# Altium schematic sheet Set Timer.SchDoc
size A; SheetNumber: 1; SheetTotal: 1
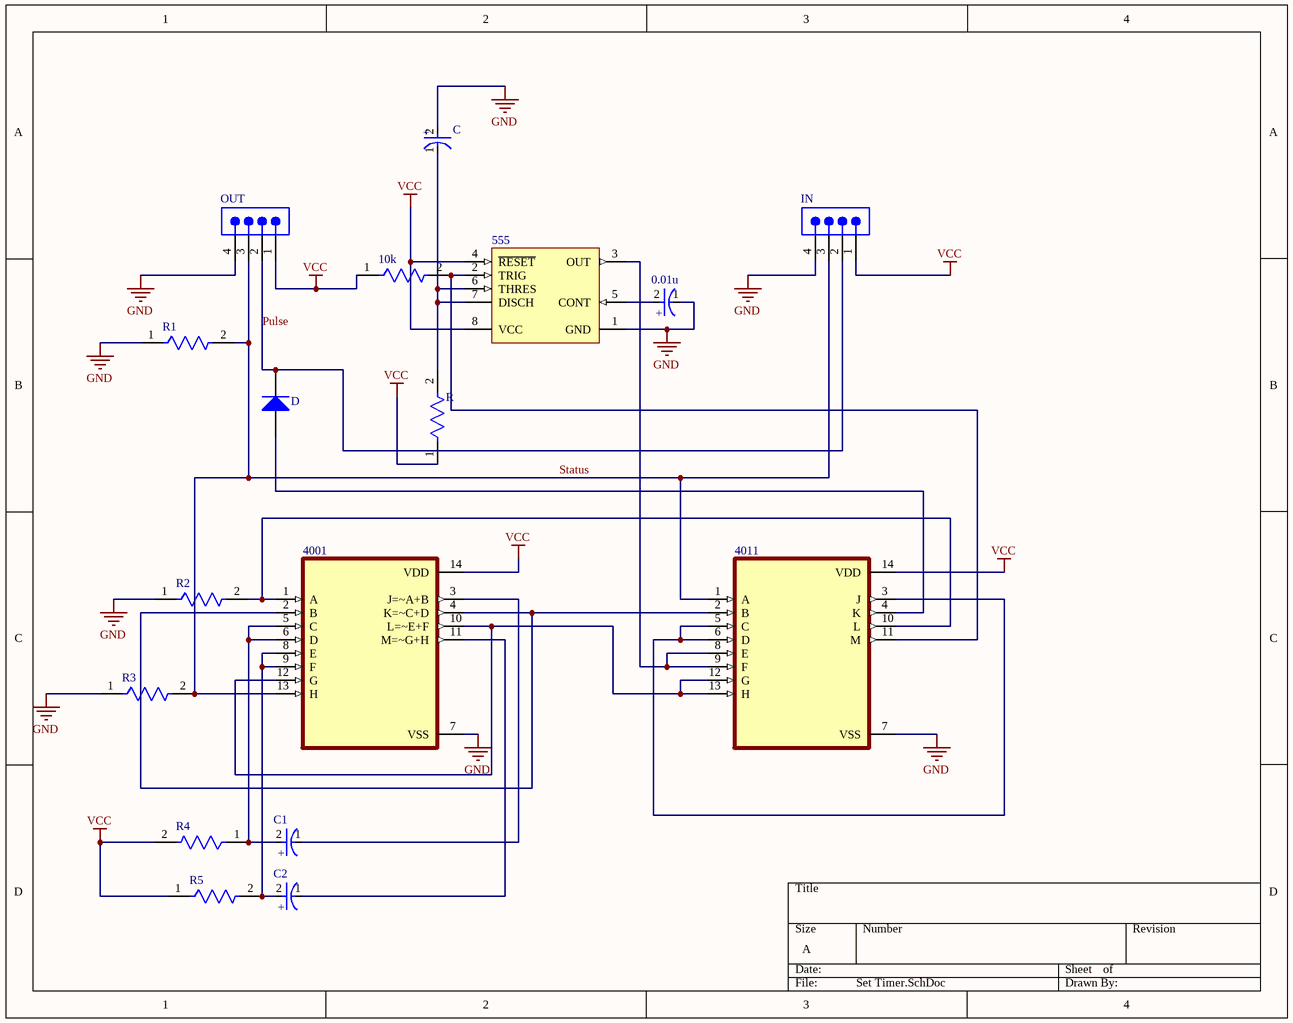
[diagram p0: Set Timer.SchDoc]

## Parts
0.01u  EEUHD1H330  [FP-RAD-TH-D_5_0_5-L_11_1-MFG]  (value not drawn)
10k  RR01J100KTB  [FP-RR01-MFG]  (value not drawn)
555  NE555P  [P0008A]  (value not drawn)
4001  CD4001BE  [DIP794W45P254L1969H508Q14]  (value not drawn)
4011  CD4011BE  [DIP794W45P254L1969H508Q14]  (value not drawn)
C  EEUHD1H330  [FP-RAD-TH-D_5_0_5-L_11_1-MFG]  (value not drawn)
C1  EEUHD1H330  [FP-RAD-TH-D_5_0_5-L_11_1-MFG]  (value not drawn)
C2  EEUHD1H330  [FP-RAD-TH-D_5_0_5-L_11_1-MFG]  (value not drawn)
D  1N4001-T  [DIOD-DO-41-P-2_V]  (value not drawn)
IN  TSW-104-08-L-S  [SMTC-TSW-104-08-X-S]  (value not drawn)
OUT  TSW-104-08-L-S  [SMTC-TSW-104-08-X-S]  (value not drawn)
R  RR01J100KTB  [FP-RR01-MFG]  (value not drawn)
R1  RR01J100KTB  [FP-RR01-MFG]  (value not drawn)
R2  RR01J100KTB  [FP-RR01-MFG]  (value not drawn)
R3  RR01J100KTB  [FP-RR01-MFG]  (value not drawn)
R4  RR01J100KTB  [FP-RR01-MFG]  (value not drawn)
R5  RR01J100KTB  [FP-RR01-MFG]  (value not drawn)

## Nets
GND: 0.01u.1(C) 555.1(GND) 4001.7(VSS) 4011.7(VSS) C.2(A) IN.4 OUT.4 R1.1 R2.1 R3.1
VCC: 10k.1 555.4(~{RESET}) 555.8(VCC) 4001.14(VDD) 4011.14(VDD) IN.1 OUT.1 R.1 R4.2 R5.1
Pulse: D.2(K) IN.2 OUT.2
Status: 4001.13(H) 4011.1(A) IN.3 OUT.3 R1.2 R3.2
Net0.01u_2: 0.01u.2(A) 555.5(CONT)
Net10k_2: 10k.2 555.2(TRIG) 4011.11(M)
Net555_3: 555.3(OUT) 4011.8(E) 4011.9(F)
Net555_6: 555.6(THRES) 555.7(DISCH) C.1(C) R.2
Net4001_1: 4001.1(A) 4011.10(L) R2.2
Net4001_2: 4001.2(B) 4001.4(K=~C+D) 4011.2(B)
Net4001_3: 4001.3(J=~A+B) C1.1(C)
Net4001_5: 4001.5(C) 4001.6(D) C1.2(A) R4.1
Net4001_8: 4001.8(E) 4001.9(F) C2.2(A) R5.2
Net4001_10: 4001.10(L=~E+F) 4001.12(G) 4011.12(G) 4011.13(H)
Net4001_11: 4001.11(M=~G+H) C2.1(C)
Net4011_3: 4011.3(J) 4011.5(C) 4011.6(D)
Net4011_4: 4011.4(K) D.1(A)

## Notes on the sheet
- (in symbol CMP-05427-001662-1) +

## Library data of the parts
0.01u C C1 C2 = CMP-05427-001662-1: Aluminum Electrolytic Capacitors (Radial Lead Type) AEC-Q200 Qualified 33uF ±20% 50V; Life (Hours): 1000Hour; Polarity: Polar; Ripple Current: 90mA; Lead/Base Style: Straight; Lead Diameter: 0.5mm; Height - Seated (Max): 0.492inch; REACH SVHC: No SVHC; Mount: Through Hole; Diameter: 5mm; Tolerance: 20%; Package Quantity: 200; Voltage Rating: 50V; Min Operating Temperature: -55°C; Series: HD; Length: 11mm; Voltage: 50V; Termination: Radial; Lead Pitch: 2.5mm; Capacitance: 33uF; Packaging: Bulk; Voltage Rating (DC): 50V; Case/Package: Radial; Max Operating Temperature: 105°C; Height: 11mm; Construction: RADIAL; RoHS Compliant: Yes; Ripple Current (AC): 90mA
10k R R1-R5 = CMP-03212-000008-1: RES 100K OHM 5% 1W AXIAL; Number of Resistors: 1; Temperature Coefficient: 300ppm/°C; Voltage Rating: 350V; Resistance: 100kR; Package Quantity: 5000; Power Rating: 1W; Packaging: Ammo Pack; Min Operating Temperature: -55°C; Number of Terminations: 2; Resistor Type: Power resistor; Length: 6.8mm; ELV: Compliant; Mount: Axial; RoHS Compliant: Yes; Case/Package: Metal; Diameter: 2.6mm; Termination: Axial; Series: RR; Max Operating Temperature: 155°C; Tolerance: 5%
555 = CMP-2000-04954-1: Precision Timer, 4.5 to 16 V, 0 to 70 degC, 8-Pin DIP, Pb-Free, Tube; Manufacturer: TexasInstruments; Maximum High Level Output Current: -200mA; Number of Internal Timers: 1; Operating Supply Voltage: 5; Maximum Low Level Output Current: 200mA; Rad Hard: No; Packaging: Rail/Tube; Manufacturer URL: http://www.ti.com/; Package Reference: P8; Package Description: 8-Pin Double In-line Package, Body 9.59 x 6.35 mm, Pitch 2.54 mm; Package URL: http://www.ti.com/lit/ml/mpdi001b/mpdi001b.pdf; Type: Standard; Datasheet URL: http://www.ti.com/general/docs/lit/getliterature.tsp?genericPartNumber=NE555&fileType=pdf; Category: Timer; Package: 8PDIP; Datasheet Version: Rev. I, 09/2014
4001 = CD4001BE: CMOS Quad 2-Input NOR Gate 14-PDIP -55 to 125; MF: Texas Instruments; Value: *; Texas_Instruments-Purchase-URL: https://snapeda.com/shop?store=Texas+Instruments&id=2748659; Availability: Unavailable; Price: None; MP: CD4001BE; Package: PDIP-14 Texas Instruments; DigiKey-Purchase-URL: https://snapeda.com/shop?store=DigiKey&id=2748659; SnapEDA_Link: https://www.snapeda.com/parts/CD4001BE/Texas%20Instruments/view-part/2748659/?ref=snap; Mouser-Purchase-URL: https://snapeda.com/shop?store=Mouser&id=2748659
D = CMP-0639-00006-2: 1.0 A Rectifier, 15 pF, 50 V, -65 to 150 degC, 2-Pin DO-41 Plastic, RoHS, Tape and Reel; Manufacturer: Diodes Inc; VF (V): 1; CT (pF): 15; Max. IR (uA): 5; VRRM (V): 50; Max. IFSM (A): 30; RoHS: TRUE; Mounting Technology: Through Hole; PartNumber: 1N4001-T; ComponentLink2Description: Datasheet; DatasheetVersion: Rev. 8-2; Operating Temperature Range (degC): -65 to 150; Packing: Tape and Reel; PackageReference: DO-41-P-2; ComponentLink1URL: http://diodes.com/; PackageDescription: 2-Pin Axial Lead, Body 4.635 x 2.36 mm, Lead Spread 25.4 mm; ComponentLink2URL: http://diodes.com/datasheets/ds28002.pdf; Max. Average Rectified Current IO (A): 1; ComponentLink1Description: Manufacturer URL
IN OUT = CMP-1024-00358-1: 0.025" SQ Post Header, Through-hole, Vertical, -55 to 125 degC, 2.54 mm Pitch, 4-Pin, Male, RoHS; Manufacturer: Samtec; Pitch: 2.54 mm; PartNumber: TSW-104-08-L-S; RoHS: True; Temperature Range: -55 to 125 degC; PackageDescription: .025[0.64] SQ. Post Terminal Strip Assembly; Orientation: Vertical; ComponentLink2URL: http://www.samtec.com/documents/webfiles/pdf/TSW_TH.PDF; ComponentLink1Description: Manufacturer URL; ComponentLink2Description: Datasheet; PackageVersion: DM, 8/1988; ComponentLink3URL: http://www.samtec.com/documents/webfiles/cpdf/TSW-XXX-XX-XXX-X-XX-XXX-MKT.pdf; Mounting Technology: Through-hole; PackageReference: TSW-104-08-X-S; ComponentLink3Description: Package Specification; ComponentLink1URL: http://www.samtec.com; DatasheetVersion: F-214
4011 = CD4011BE: Package: None; MP: CD4011BE; Value: *; Availability: Unavailable; Price: None